# EAGLE design Temperature Senor Board V2 (2) (EAGLE 9.2.2)
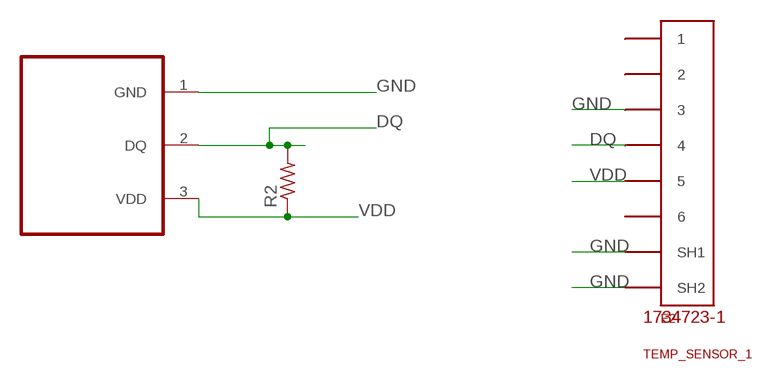
[diagram p0: schematic, sheet 1]

## Parts
E2  TEMP_SENSOR_1  5555140-6  [1734723-1_RJ11]
R2  R-US_R0805  [R0805]
U$1  DS18B  [TO92]

## Nets
DQ: E2.4 R2.2 U$1.2(DQ)
GND: E2.3 E2.SH1 E2.SH2 U$1.1(GND)
VDD: E2.5 R2.1 U$1.3(VDD)
Unconnected: E2.1 E2.2 E2.6

## Library data of the parts
E2 = 5555140-6 RJ11:5555140-6
R2 = rcl:R-US_: RESISTOR, American symbol; SPICEPREFIX: R
U$1 = temperatureboardElizabeth:DS18B

## Module TEM
Ports: 

### Library data of the parts

## Board
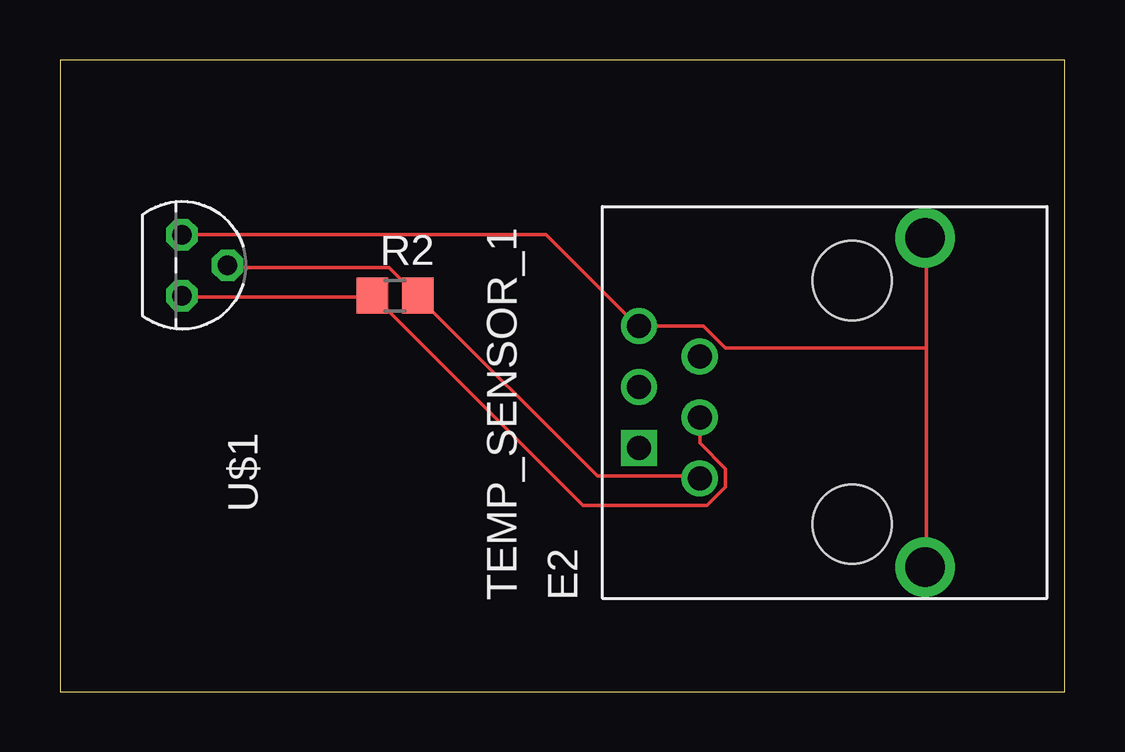
[diagram p1: board, top side]

Size 41.89 x 26.34 mm. Coordinates in mm from the lower left corner, seen from the top.
Outline: 0,0 41.89,0 41.89,26.34 0,26.34 0,0
Copper layers (1*16): Top 0.035mm / dielectric 1.5mm / Bottom 0.035mm
Design rules "default": minimum track width 6mil, minimum drill 0.35mm, track to track 6mil, track to pad 6mil, pad to pad 6mil, via to via 6mil, smd to smd 6mil, copper to edge 40mil, drill to drill 6mil, minimum pad ring 10mil, minimum via ring 8mil, stop-mask expansion 4mil, vias tented up to drill 0mil, thermal gap 10mil

### Footprints (pad centres in the part's own frame; a part is rotated, then mirrored left to right if it is on the bottom)
1734723-1_RJ11 = drill 1 square: 1 -2.54,2.54 | drill 1: 2 0,2.54; 3 2.54,2.54; 4 -3.81,0; 5 -1.27,0; 6 1.27,0 | drill 1.65: SH1 -7.5,-9.4; SH2 6.22,-9.4 | hole 3.3: -5.72,-6.35; 4.44,-6.35
R0805 = smd 1.3 x 1.5: 1 -0.95,0; 2 0.95,0
TO92 = drill 0.813 octagon: 1 -1.27,0; 2 0,1.905; 3 1.27,0

### Placement (x,y rotation side)
E2  26.67,12.7 90 top
R2  13.97,16.51 0 top
U$1  5.08,17.78 270 top

### Tracks (layer width: path | path; a pad name or v marks a point on that pad's centre or on a via)
DQ
  Top 0.152: U$1.2 7.01,17.68 13.72,17.68 14.78,16.61 R2.2 14.94,16.46 22.4,8.99 26.67,8.99 E2.4
GND
  Top 0.152: 36.12,14.33 36.12,18.9 E2.SH2 | 36.12,14.33 36.12,5.33 E2.SH1 | U$1.1 20.27,19.05 24.08,15.24 E2.3 26.82,15.24 27.74,14.33 36.12,14.33
VDD
  Top 0.152: U$1.3 5.18,16.46 12.95,16.46 R2.1 13.11,16.46 21.79,7.77 26.98,7.77 27.74,8.53 27.74,9.3 26.67,10.36 E2.5